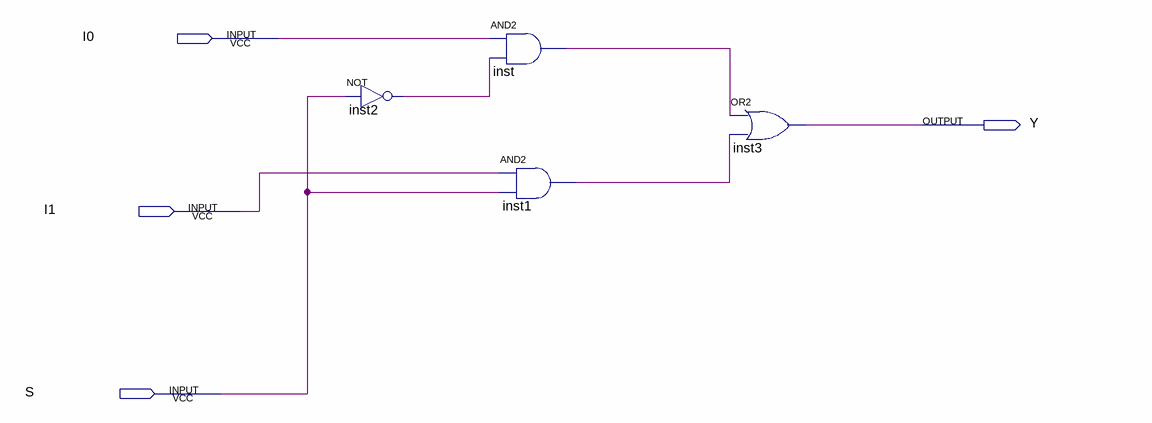
[diagram p0: schematic sheet]
// Quartus schematic mu2to1.bdf as structural Verilog: 4 symbols, 4 pins
module mu2to1 (
  input  I0,
  input  I1,
  input  S,
  output Y
);

  wire inst1_out, inst2_out, inst_out;

  not inst2 (inst2_out, S);
  and inst (inst_out, I0, inst2_out);
  and inst1 (inst1_out, I1, S);
  or inst3 (Y, inst_out, inst1_out);
endmodule
